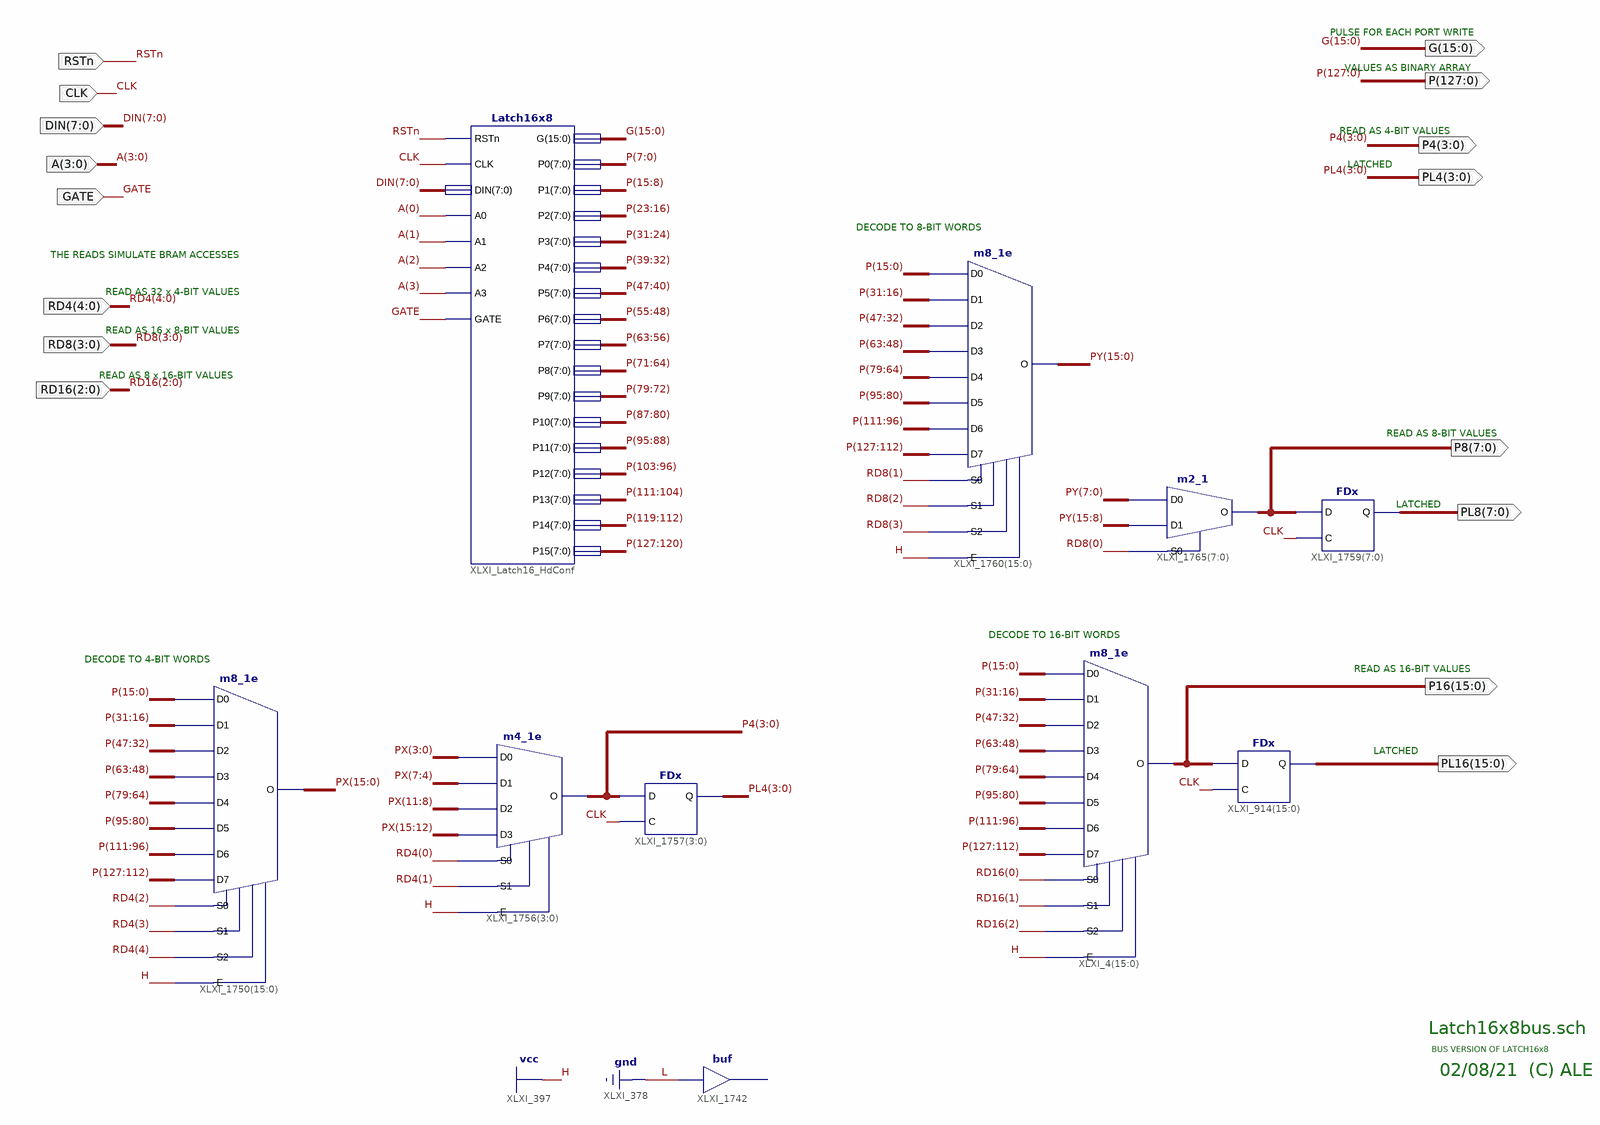
[diagram p0: schematic sheet 1]
// Xilinx ISE schematic Latch16x8bus.sch (spartan3e) as structural Verilog: 10 symbols, 16 ports
module Latch16x8bus (
  input  RSTn,
  input  [7:0] DIN,
  input  CLK,
  input  [3:0] A,
  input  GATE,
  input  [4:0] RD4,
  input  [2:0] RD16,
  input  [3:0] RD8,
  output [15:0] G,
  output [3:0] P4,
  output [3:0] PL4,
  output [127:0] P,
  output [7:0] P8,
  output [7:0] PL8,
  output [15:0] PL16,
  output [15:0] P16
);

  wire [15:0] PX, PY;

  // buf XLXI_1742 has open pins: I=1'b0, O=open
  Latch16x8 XLXI_Latch16_HdConf (
    .A0(A[0]), .A1(A[1]), .A2(A[2]), .A3(A[3]), .CLK(CLK), .DIN(DIN), .G(G), .GATE(GATE), .P0(P[7:0]),
    .P1(P[15:8]), .P10(P[87:80]), .P11(P[95:88]), .P12(P[103:96]), .P13(P[111:104]), .P14(P[119:112]),
    .P15(P[127:120]), .P2(P[23:16]), .P3(P[31:24]), .P4(P[39:32]), .P5(P[47:40]), .P6(P[55:48]),
    .P7(P[63:56]), .P8(P[71:64]), .P9(P[79:72]), .RSTn(RSTn));
  m8_1e XLXI_1750[15:0] (
    .D0(P[15:0]), .D1(P[31:16]), .D2(P[47:32]), .D3(P[63:48]), .D4(P[79:64]), .D5(P[95:80]), .D6(P[111:96]),
    .D7(P[127:112]), .E(1'b1), .S0(RD4[2]), .S1(RD4[3]), .S2(RD4[4]), .O(PX));
  m4_1e XLXI_1756[3:0] (
    .D0(PX[3:0]), .D1(PX[7:4]), .D2(PX[11:8]), .D3(PX[15:12]), .E(1'b1), .S0(RD4[0]), .S1(RD4[1]), .O(P4));
  FDx XLXI_1757[3:0] (.C(CLK), .D(P4), .Q(PL4));
  FDx XLXI_1759[7:0] (.C(CLK), .D(P8), .Q(PL8));
  m2_1 XLXI_1765[7:0] (.D0(PY[7:0]), .D1(PY[15:8]), .S0(RD8[0]), .O(P8));
  m8_1e XLXI_1760[15:0] (
    .D0(P[15:0]), .D1(P[31:16]), .D2(P[47:32]), .D3(P[63:48]), .D4(P[79:64]), .D5(P[95:80]), .D6(P[111:96]),
    .D7(P[127:112]), .E(1'b1), .S0(RD8[1]), .S1(RD8[2]), .S2(RD8[3]), .O(PY));
  m8_1e XLXI_4[15:0] (
    .D0(P[15:0]), .D1(P[31:16]), .D2(P[47:32]), .D3(P[63:48]), .D4(P[79:64]), .D5(P[95:80]), .D6(P[111:96]),
    .D7(P[127:112]), .E(1'b1), .S0(RD16[0]), .S1(RD16[1]), .S2(RD16[2]), .O(P16));
  FDx XLXI_914[15:0] (.C(CLK), .D(P16), .Q(PL16));

  // Notes on the sheet:
  //   PULSE FOR EACH PORT WRITE
  //   VALUES AS BINARY ARRAY
  //   READ AS 4-BIT VALUES
  //   LATCHED
  //   DECODE TO 8-BIT WORDS
  //   THE READS SIMULATE BRAM ACCESSES
  //   READ AS 32 x 4-BIT VALUES
  //   READ AS 16 x 8-BIT VALUES
  //   READ AS 8 x 16-BIT VALUES
  //   READ AS 8-BIT VALUES
  //   LATCHED
  //   DECODE TO 16-BIT WORDS
  //   DECODE TO 4-BIT WORDS
  //   READ AS 16-BIT VALUES
  //   LATCHED
  //   Latch16x8bus.sch
  //   BUS VERSION OF LATCH16x8
  //   02/08/21  (C) ALE
endmodule
